# Altium schematic sheet PCB_temp.SchDoc
size A4; SheetNumber: 4; SheetTotal: 5
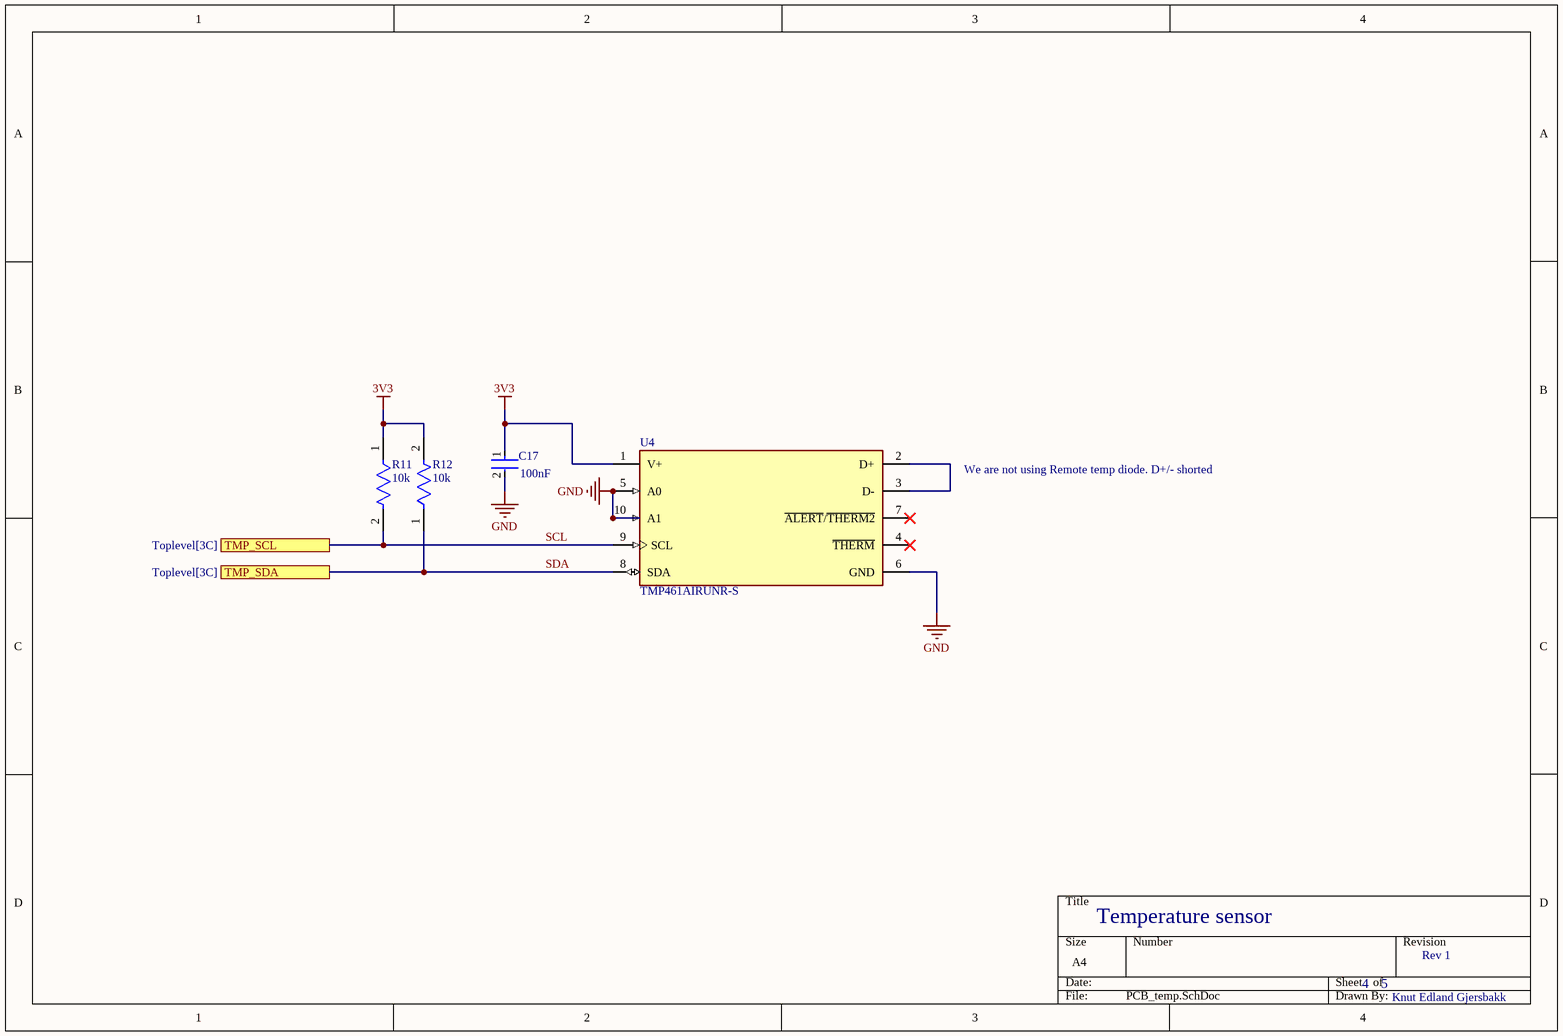
[diagram p0: PCB_temp.SchDoc]

## Parts
C17  100nF  [FP-CL10-IPC_A]
R11  10k  [FP-RT0603-IPC_C]
R12  10k  [FP-RT0603-IPC_C]
U4  TMP461AIRUNR-S  [FP-RUN0010A-MFG]

## Ports
TMP_SCL (see Toplevel[3C]), TMP_SDA (see Toplevel[3C])

## Nets
3V3: C17.1 R11.1 R12.2 U4.1(V+)
GND: C17.2 U4.5(A0) U4.6(GND) U4.10(A1)
SCL: R11.2 U4.9(SCL) ; port TMP_SCL
SDA: R12.1 U4.8(SDA) ; port TMP_SDA
NetU4_2: U4.2(D+) U4.3(D-)

Not connected (* = marked no-connect by the designer): U4 4(~{THERM})* 7(~{ALERT}/~{THERM2})*

## Notes on the sheet
- We are not using Remote temp diode. D+/- shorted
- Temperature sensor
- 4
- 5
- Rev 1
- Knut Edland Gjersbakk

## Library data of the parts
C17 = CMP-13271-002683-1: Cap Ceramic 100nF 16V X7R ±10% Pad SMD 0603 +125°C T/R; Voltage Rating: 16V; Max Operating Temperature: 125°C; Capacitance: 100nF; Features: Soft Termination; Length: 0.063inch; Packaging: Tape and Reel; Min Operating Temperature: -55°C; Mount: Surface Mount; Case/Package: 0603; Case Code (Metric): 1608; Width: 0.031inch; Ratings: AEC-Q200; Thickness: 0.035inch; Case Code (Imperial): 0603; Tolerance: 10%
R11 R12 = CMP-03412-005349-1: RES SMD 10K OHM 1% 1/10W 0603 / RT0603FRE0710KL; Manufacturer: Yageo; Value: 10KΩ; Temperature Coefficient: 50 ppm/°C; Power Rating: 0.1W; Tolerance: 0.01; Voltage Rating: 75V; RoHS: TRUE; Category: Res; Automotive: No; Digikey Description: RES SMD 10K OHM 1% 1/10W 0603; ComponentLink2Description: Datasheet; Octopart: https://octopart.com/rt0603fre0710kl-yageo-40009243; ComponentLink2URL: http://www.yageo.com/documents/recent/PYu-RT_1-to-0.01_RoHS_L_9.pdf; Device Class L3: Chip SMD Resistors; Device Class L1: Passive Components; Temperature Range High: +155°C; Height: 0.55mm; Composition: Thin Film; Ipc Land Pattern Name: RESC16080X45; Series: RT; Package: RT0603; Resistance: 10KΩ; Footprint Url: http://www.yageo.com/exep/pages/download/literatures/PYu-R_Mount_10.pdf; Temperature: -55°C to +155°C; Temperature Range Low: -55°C; Lead Free: Yes; Device Class L2: Resistors; Mouser Description: Thin Film Resistors - SMD 10K ohm 1% 1/10W; Manufacturer Part Number: RT0603FRE0710KL
U4 = CMP-00370-103943066-1: TMP461AIRUNR-S Temperature Sensor Digital, Local/Remote -40°C ~ 125°C 11 b 10-WQFN (2x2); Manufacturer Lifecycle Status: ACTIVE; NexarPartId: 103943066; Height: 0m; Thickness: 750µm; Number of Pins: 10; Schedule B: 8542390000, 8542390000; Width: 2mm; Length: 2mm; Lifecycle Status: Production